# EAGLE design SparkFun Qwiic ToF Imager - VL53L5CX - Mini (EAGLE 9.6.2)
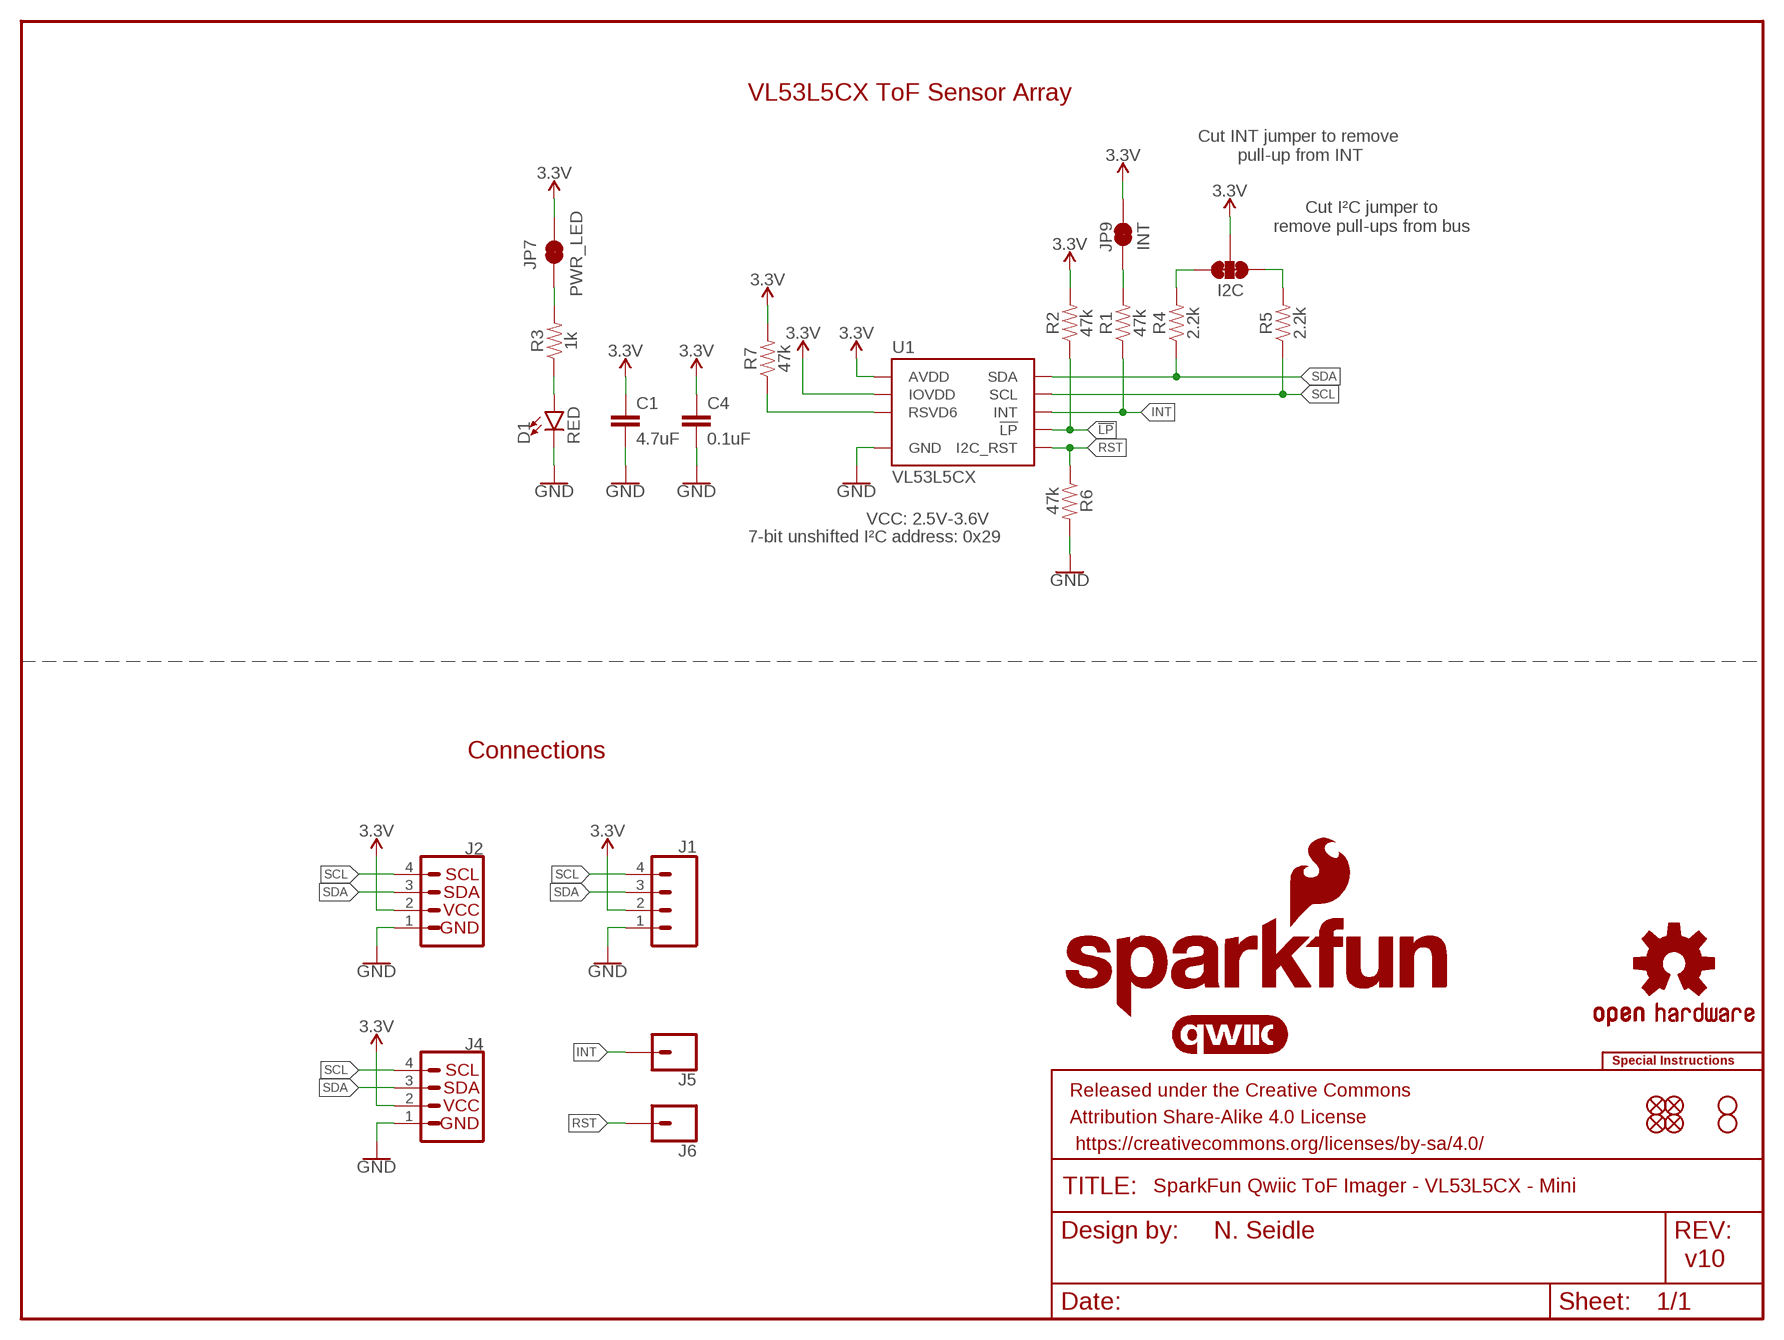
[diagram p0: schematic, sheet 1]

## Parts
C1  4.7uF  4.7UF-0402_TIGHT-6.3V-20%-X5R  [0402-TIGHT]
C4  0.1uF  0.1UF-0402T-6.3V-10%-X7R  [0402-TIGHT]
D1  RED  LED-RED0603  [LED-0603]
FRAME1  FRAME-LETTER  [CREATIVE_COMMONS]
I2C  JUMPER-SMT_3_2-NC_TRACE_SILK  [SMT-JUMPER_3_2-NC_TRACE_SILK]
J1  CONN_041X04_NO_SILK  [1X04_NO_SILK]
J2  Vertical Qwiic Connector  QWIIC_CONNECTOR  [JST04_1MM_VERT]
J4  Vertical Qwiic Connector  QWIIC_CONNECTOR  [JST04_1MM_VERT]
J5  CONN_01PTH_NO_SILK_YES_STOP  [1X01_NO_SILK]
J6  CONN_01PTH_NO_SILK_YES_STOP  [1X01_NO_SILK]
JP1  FIDUCIALUFIDUCIAL  [FIDUCIAL-MICRO]
JP2  FIDUCIALUFIDUCIAL  [FIDUCIAL-MICRO]
JP5  FIDUCIALUFIDUCIAL  [FIDUCIAL-MICRO]
JP6  FIDUCIALUFIDUCIAL  [FIDUCIAL-MICRO]
JP7  PWR_LED  JUMPER-SMT_2_NC_TRACE_SILK  [SMT-JUMPER_2_NC_TRACE_SILK]
JP9  INT  JUMPER-SMT_2_NC_TRACE_SILK  [SMT-JUMPER_2_NC_TRACE_SILK]
JP10  STAND-OFF  [STAND-OFF]
JP11  STAND-OFF  [STAND-OFF]
LOGO1  SFE_LOGO_NAME_FLAME8_MM  [SFE_LOGO_NAME_FLAME_8MM]
LOGO2  OSHW-LOGONO_SILK  [DUMMY]
LOGO3  QWIIC_LOGO_CONNECTOR  [QWIIC_5.5MM]
LOGO4  SFE_LOGO_NAME6_MM  [SFE_LOGO_NAME_6MM]
LOGO5  SPECIAL_INSTRUCTIONS-ORDERING  [ORDERING_INSTRUCTIONS]
R1  47k  47KOHM-0402-1/10W-1%  [0402-TIGHT]
R2  47k  47KOHM-0402-1/10W-1%  [0402-TIGHT]
R3  1k  1KOHM-0402T-1/16W-1%  [0402-TIGHT]
R4  2.2k  2.2KOHM-0402T-1/16W-1%  [0402-TIGHT]
R5  2.2k  2.2KOHM-0402T-1/16W-1%  [0402-TIGHT]
R6  47k  47KOHM-0402-1/10W-1%  [0402-TIGHT]
R7  47k  47KOHM-0402-1/10W-1%  [0402-TIGHT]
U1  VL53L5CX  [VL53L5CX]

## Nets
3.3V: C1.1 C4.1 I2C.2 J1.2 J2.2 J4.2 JP7.2 JP9.2 R2.2 R7.2 U1.A4(IOVDD) U1.B1(AVDD) U1.B7(AVDD)
!LP: R2.1 U1.A5(!LP)
GND: C1.2 C4.2 D1.C J1.1 J2.1 J4.1 R6.2 U1.A2(GND) U1.A6(GND) U1.A7(GND) U1.B4(GND) U1.C1(GND) U1.C6(GND) U1.C7(GND)
INT: J5.1 R1.1 U1.A3(INT)
N$1: I2C.1 R5.2
N$2: I2C.3 R4.2
N$3: D1.A R3.1
N$4: JP9.1 R1.2
N$5: JP7.1 R3.2
N$6: R7.1 U1.C2(RSVD6)
RST: J6.1 R6.1 U1.A1(I2C_RST)
SCL: J1.4 J2.4 J4.4 R5.1 U1.C4(SCL)
SDA: J1.3 J2.3 J4.3 R4.1 U1.C3(SDA)

## Notes on the sheet
- VL53L5CX ToF Sensor Array
- Cut INT jumper to remove 
  pull-up from INT
- Cut I²C jumper to
  remove pull-ups from bus
- VCC: 2.5V-3.6V
- 7-bit unshifted I²C address: 0x29
- Connections
- N. Seidle
- v10

## Library data of the parts
C1 = SparkFun-Capacitors:4.7UF: 4.7µF ceramic capacitors A capacitor is a passive two-terminal electrical component used to store electrical energy temporarily in an electric field.; PROD_ID: CAP-14240
C4 = SparkFun-Capacitors:0.1UF: 0.1µF ceramic capacitors A capacitor is a passive two-terminal electrical component used to store electrical energy temporarily in an electric field.; PROD_ID: CAP-14993
D1 = SparkFun-LED:LED-RED: Red SMD LED Used in manufacturing of most products at SparkFun Packages: 0603 - SMD 0603 package [Product Link] <http://docs.avagotech.com/docs/AV02-0551EN> 0603 SMART - SMD 0603 SMART package ( more efficient and expensive)[Product Link] <http://www.osram-os.com/Graphics/XPic2/00077099_0.pdf> 1206 - SMD1206 package [Product Link] <https://www.sparkfun.com/datasheets/DevTools/LilyPad/Q150OVS4.pdff> SparkFun Products: Pro Mini 328 -5V <https://www.sparkfun.com/products/821> RedBoard <https://www.sparkfun.com/products/12757> IOIO-OTG <https://www.sparkfun.com/products/13613>; PROD_ID: DIO-00819
FRAME1 = SparkFun-Aesthetics:FRAME-LETTER: Schematic Frame - Letter Standard 8.5x11 US Letter frame
I2C = SparkFun-Jumpers:JUMPER-SMT_3_2-NC_TRACE: Normally closed trace jumper (2 of 2 connections) This jumper has a trace between all three pads so they are normally closed (NC). Use a razor knife to open the connection(s). For best results follow the IPC guidelines for cutting traces: Cutout at least 0.063 mm (0.005 in). Remove all loose material to clean up the cut area. Seal the cut with an approved epoxy. Reapply solder to reclose the connection(s).
J1 = SparkFun-Connectors:CONN_04: Multi connection point. Often used as Generic Header-pin footprint for 0.1 inch spaced/style header connections On any of the 0.1 inch spaced packages, you can populate with these: Break Away Headers - Straight <https://www.sparkfun.com/products/116> (PRT-00116) Break Away Male Headers - Right Angle <https://www.sparkfun.com/products/553> (PRT-00553) Female Headers <https://www.sparkfun.com/products/115> (PRT-00115) Break Away Headers - Machine Pin <https://www.sparkfun.com/products/117> (PRT-00117) Break Away Female Headers - Swiss Machine Pin <https://www.sparkfun.com/products/743> (PRT-00743) For SCREWTERMINALS and SPRING TERMINALS visit here: Screw Terimnals on SparkFun.com <https://www.sparkfun.com/search/results?term=Screw+Terminals> (5mm/3.5mm/2.54mm spacing) This device is also useful as a general connection point to wire up your design to another part of your project. Our various solder wires solder well into these plated through hole pads. Hook-Up Wire - Assortment (Stranded, 22 AWG) <https://www.sparkfun.com/products/11375> (PRT-11375) Hook-Up Wire - Assortment (Solid Core, 22 AWG) <https://www.sparkfun.com/products/11367> (PRT-11367) View the entire wire category on our website here <https://www.sparkfun.com/categories/141> Special notes: Molex polarized connector foot print use with SKU : PRT-08231 with associated crimp pins and housings. 1MM SMD Version SKU: PRT-10208; PROD_ID: CONN-09696
J2 J4 = SparkFun-Connectors:QWIIC_CONNECTOR: SparkFun I2C Standard Qwiic Connector An SMD 1mm pitch JST connector makes it easy and quick (get it? Qwiic?) to connect I2C devices to each other. The Qwiic system <http://www.sparkfun.com/qwiic> enables fast and solderless connection between popular platforms and various sensors and actuators. We carry 200mm <https://www.sparkfun.com/products/14204>, 100mm <https://www.sparkfun.com/products/14205>, 50mm <https://www.sparkfun.com/products/14206>, and breadboard friendly <https://www.sparkfun.com/products/14207> Qwiic cables. We also offer 10 pcs strips <https://www.sparkfun.com/products/14323> the SMD connectors.; PROD_ID: CONN-14483
J5 J6 = SparkFun-Connectors:CONN_01: Single connection point. Often used as Generic Header-pin footprint for 0.1 inch spaced/style header connections On any of the 0.1 inch spaced packages, you can populate with these: Break Away Headers - Straight <https://www.sparkfun.com/products/116> (PRT-00116) Break Away Male Headers - Right Angle <https://www.sparkfun.com/products/553> (PRT-00553) Female Headers <https://www.sparkfun.com/products/115> (PRT-00115) Break Away Headers - Machine Pin <https://www.sparkfun.com/products/117> (PRT-00117) Break Away Female Headers - Swiss Machine Pin <https://www.sparkfun.com/products/743> (PRT-00743) This device is also useful as a general connection point to wire up your design to another part of your project. Our various solder wires solder well into these plated through hole pads. Hook-Up Wire - Assortment (Stranded, 22 AWG) <https://www.sparkfun.com/products/11375> (PRT-11375) Hook-Up Wire - Assortment (Solid Core, 22 AWG) <https://www.sparkfun.com/products/11367> (PRT-11367) View the entire wire category on our website here <https://www.sparkfun.com/categories/141> Special notes: SMTSO-256-ET is a "flush mount" nut for a 4-40 screw. We mostly use this on specialty testbeds; it is a nice way to connect hardware to your PCB at an adjustable hieght. Also note, the SNAP packages are for using a snappable style connector. We sell a baggie of snaps and they are also used on two LilyPad designs: Snap Assortment - 30 pack (male and female) <https://www.sparkfun.com/products/11347> (DEV-11347) LilyPad Arduino SimpleSnap <https://www.sparkfun.com/products/10941> (DEV-10941) LilyPad SimpleSnap Protoboard <https://www.sparkfun.com/products/10940> (DEV-10940)
JP1 JP2 JP5 JP6 = SparkFun-Aesthetics:FIDUCIAL: Fiducial Alignment Points Point-of-reference for pick-and-place machines and other optical instruments.
JP7 JP9 = SparkFun-Jumpers:JUMPER-SMT_2_NC_TRACE: Normally closed trace jumper This jumper has a trace between two pads so it's normally closed (NC). Use a razor knife to open the connection. For best results follow the IPC guidelines for cutting traces: Cutout at least 0.063 mm (0.005 in). Remove all loose material to clean up the cut area. Seal the cut with an approved epoxy. Reapply solder to reclose the connection.
JP10 JP11 = SparkFun-Hardware:STAND-OFF: Stand Off Drill holes for mechanically mounting via screws, standoffs, etc. Note: Use the keepout ring to avoid running the screw head into surrounding components. Variant Overviews STAND-OFF - Mechanical footprint for a #4 phillips button head screw. STAND-OFF-TIGHT - Mechanical footprint for a #4 phillips button head screw, Example SparkFun Products Screw - Phillips Head (1/4", 4-40, 10 pack) <https://www.sparkfun.com/products/10453> (PRT-10453) Screw - Phillips Head (1/2", 4-40, 10 pack) <https://www.sparkfun.com/products/10452> (PRT-10452) Screw - Phillips Head (3/4", 4-40, 10 pack) <https://www.sparkfun.com/products/10451> (PRT-10451) Screw - Phillips Head (1", 4-40, 10 pack) <https://www.sparkfun.com/products/10450> (PRT-10450)
LOGO1 = SparkFun-Aesthetics:SFE_LOGO_NAME_FLAME: SparkFun Font Logo w/ Flame This is the SparkFun full logo. The logo on the schematic will always be the same size; the package variant is the height of the flame part of the logo. Default layer for the logo on the board is tSilk.
LOGO2 = SparkFun-Aesthetics:OSHW-LOGO: Open-Source Hardware (OSHW) Logo This logo indicates the piece of hardware it is found on incorporates a OSHW license and/or adheres to the definition of open source hardware found here: http://freedomdefined.org/OSHW
LOGO3 = SparkFun-Aesthetics:QWIIC_LOGO: Qwiic Logos for placement on schematic and PCB. The 5.5mm silk logo is best for placing next to Qwiic connector.
LOGO4 = SparkFun-Aesthetics:SFE_LOGO_NAME: SparkFun Font Logo This is the SparkFun name logo. The logo on the schematic will always be the same size; the package variant is the height of the flame part of the logo (or the height the flame would be, if it were drawn). Default layer for the logo on the board is tSilk.
LOGO5 = SparkFun-Aesthetics:SPECIAL_INSTRUCTIONS: Special Ordering/Production Instructions Alert Symbol for special PCB ordering instructions or unique production process warnings. Ordering Instructions Production Instructions Types of information that should be added to box: Copper weight Soldermask color Silk color PCB thickness Number of layers PCB Standard: 1.6mm FR4 1 oz copper immersion silver plating red soldermask white silkscreen Types of information that should be added to box: Special wash requirements Depaneling instructions Humidification Glue curing Default text settings: 0.07 inch 9% ratio 50% line distance
R1 R2 R6 R7 = SparkFun-Resistors:47KOHM: 47kΩ resistor A resistor is a passive two-terminal electrical component that implements electrical resistance as a circuit element. Resistors act to reduce current flow, and, at the same time, act to lower voltage levels within circuits. - Wikipedia; PROD_ID: RES-15011
R3 = SparkFun-Resistors:1KOHM: 1kΩ resistor A resistor is a passive two-terminal electrical component that implements electrical resistance as a circuit element. Resistors act to reduce current flow, and, at the same time, act to lower voltage levels within circuits. - Wikipedia; PROD_ID: RES-14342
R4 R5 = SparkFun-Resistors:2.2KOHM: 2.2kΩ resistor A resistor is a passive two-terminal electrical component that implements electrical resistance as a circuit element. Resistors act to reduce current flow, and, at the same time, act to lower voltage levels within circuits. - Wikipedia; PROD_ID: RES-14341
U1 = SparkFun-Sensors:VL53L5CX; PROD_ID: IC-16254

## Net classes
1 power: width 0.203 mm

## Board
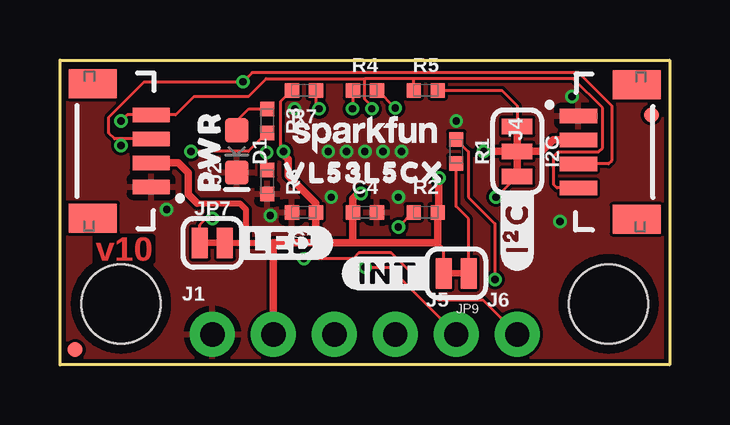
[diagram p1: board, top side]
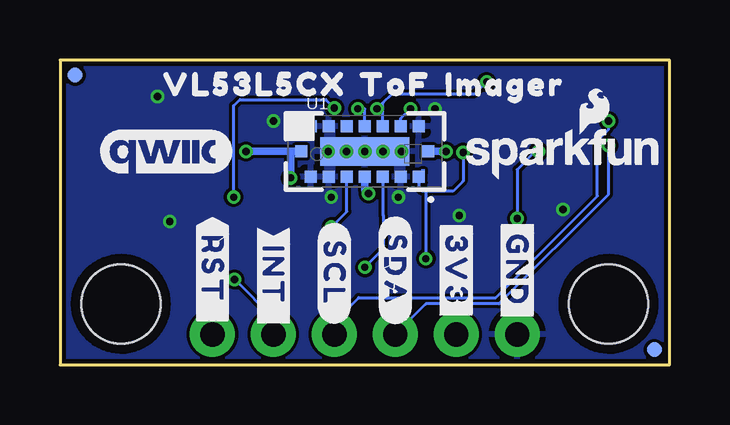
[diagram p2: board, bottom side, seen from below]

Size 25.4 x 12.7 mm. Coordinates in mm from the lower left corner, seen from the top.
Outline: 0,0 0,12.7 25.4,12.7 25.4,0 0,0
Copper layers (1*16): Top/Vert 0.035mm / dielectric 1.5mm / Bottom/Horz 0.035mm
Design rules "SparkFun-2-Layer-Minimum-JLCPCB": minimum track width 5mil, minimum drill 0.3mm, track to track 5mil, track to pad 5mil, pad to pad 5mil, via to via 5mil, smd to smd 5mil, copper to edge 7mil, drill to drill 7mil, minimum pad ring 5mil, minimum via ring 5mil, stop-mask expansion 2.5mil, vias tented up to drill 25mil, thermal gap 10mil

### Footprints (pad centres in the part's own frame; a part is rotated, then mirrored left to right if it is on the bottom)
0402-TIGHT = smd 0.6 x 0.6: 1 -0.5,0; 2 0.5,0
LED-0603 = smd 1 x 1: A -0.877,0; C 0.877,0
SMT-JUMPER_3_2-NC_TRACE_SILK = smd 0.66 x 1.27: 1 -1.041,0; 2 0,0; 3 1.041,0
1X04_NO_SILK = drill 1.016 pad 1.88: 1 0,0; 2 2.54,0; 3 5.08,0; 4 7.62,0
JST04_1MM_VERT = smd 0.6 x 1.55: 1 -1.478,0.775; 2 -0.478,0.775; 3 0.522,0.775; 4 1.522,0.775 | smd 1.2 x 2: NC1 -2.778,3.2; NC2 2.822,3.2
1X01_NO_SILK = drill 1.016 pad 1.88: 1 0,0
FIDUCIAL-MICRO = smd 0.635 x 0.635: 1 0,0
SMT-JUMPER_2_NC_TRACE_SILK = smd 0.66 x 1.27: 1 -0.521,0; 2 0.521,0
STAND-OFF = hole 3.302: 0,0
VL53L5CX = smd 0.5 x 0.5: A1 2.25,-1.05; A2 1.5,-1.05; A3 0.75,-1.05; A4 0,-1.05; A5 -0.75,-1.05; A6 -1.5,-1.05; A7 -2.25,-1.05; B1 2.65,0; B7 -2.65,0; C1 2.25,1.05; C2 1.5,1.05; C3 0.75,1.05; C4 0,1.05; C5 -0.75,1.05; C6 -1.5,1.05; C7 -2.25,1.05 | smd 3.7 x 1.2: B4 0,0

### Placement (x,y rotation side)
C1  10.16,6.35 180 top
C4  12.7,6.35 0 top
D1  7.37,8.89 270 top
FRAME1  -14.63,-15.24 0 top  (outside the outline)
I2C  19.05,8.89 270 top
J1  6.35,1.27 0 top
J2  4.57,8.89 90 top
J4  20.83,8.89 270 top
J5  16.51,1.27 0 top
J6  19.05,1.27 0 top
JP1  0.64,0.64 0 bottom
JP2  24.64,10.41 0 top
JP5  24.77,12.06 0 bottom
JP6  0.64,0.64 0 top
JP7  6.35,5.08 0 top
JP9  16.51,3.81 180 top
JP10  2.54,2.54 0 top
JP11  22.86,2.54 0 top
LOGO1  4.47,8.89 0 bottom
LOGO2  -13.97,-15.24 0 top  (outside the outline)
LOGO3  20.98,8.89 0 bottom
LOGO4  12.7,9.65 0 top
LOGO5  30.48,50.8 0 top  (outside the outline)
R1  16.51,8.89 270 top
R2  15.24,6.35 0 top
R3  8.64,10.16 270 top
R4  12.7,11.43 0 top
R5  15.24,11.43 0 top
R6  8.64,7.62 270 top
R7  10.16,11.43 180 top
U1  12.7,8.89 0 bottom
U$1  [VL53L5CX_0]  12.83,8 0 top
U$2  [#LED#0]  9.27,5.08 0 top
U$3  [#3V3#13]  8.89,3.94 270 bottom
U$4  [PWR12]  6.22,8.89 90 top
U$5  [#INT#0]  13.72,3.81 0 top
U$8  [#INT_#0]  16.51,3.56 270 bottom
U$9  [#RST_#1]  19.05,3.81 270 bottom
U$16  [#I�C#0]  19.05,5.71 90 top
U$19  [VL53L5CX0]  17.27,11.68 0 bottom
U$20  [TOF1]  11.43,11.68 0 bottom
U$22  [IMAGER2]  6.86,11.68 0 bottom
U$24  [#SCL#1]  13.97,3.81 270 bottom
U$25  [#SDA#0]  11.43,3.94 270 bottom
U$30  [#GND#62130]  6.35,3.94 270 bottom

### Tracks (layer width: path | path; a pad name or v marks a point on that pad's centre or on a via)
3.3V  (via drill 0.3)
  Top/Vert 0.127: 12.2,5.09 12.19,5.08 | 10.66,5.09 10.67,5.08 | 9.31,8.77 v9.31,8.89 9.18,9.02 9.18,10.96 R7.2 | 15.79,6.4 R2.2 | JP9.2 15.99,4.84 15.75,5.08
  Top/Vert 0.254: JP7.2 7.75,5.08 | 7.75,5.08 8.89,5.08 | 7.75,5.08 7.75,6.48 7.49,6.73 5.71,6.73
  Top/Vert 0.305: J4.2 20.54,9.37 20.07,8.89 I2C.2 v17.65,8.89 | 5.71,6.73 5.33,7.11 5.33,8 4.92,8.41 J2.2 | 12.2,5.09 C4.1 12.2,6.92 12.42,7.14 v12.54,7.14 | 10.66,5.09 C1.1 10.66,6.74 9.52,7.88 9.52,8.56 9.31,8.77 | v15.79,7.79 15.79,6.4 | R2.2 15.75,5.08 12.19,5.08 10.67,5.08 8.89,5.08 J1.2
  Bottom/Horz 0.127: 15.79,8.85 15.75,8.89
  Bottom/Horz 0.305: v12.54,7.14 12.7,7.29 U1.A4 | U1.B1 v9.31,8.89 | v17.65,8.89 15.75,8.89 U1.B7 | v15.79,7.79 15.79,8.85
!LP  (via drill 0.3)
  Top/Vert 0.127: R2.1 14.71,6.35 v14.1,5.74
  Bottom/Horz 0.127: v14.1,5.74 13.45,6.39 U1.A5
GND  (via drill 0.3)
  other vias: 4.45,6.48 12.7,8.89 11.94,8.89 11.18,8.89 13.46,8.89 14.22,8.89 21.34,11.18 16.51,10.16 14.1,6.99 8.76,6.22 11.3,6.99 20.83,5.97 9.78,10.67
  pour Bottom/Horz (isolate 0.127): 0,0 0,12.7 25.4,12.7 25.4,0
  pour Top/Vert (isolate 0.127): 0,0 0,12.7 25.4,12.7 25.4,0
  pour Bottom/Horz (isolate 0.178, no thermals): 14.35,10.03 14.35,7.62 13.97,7.62 13.97,10.03
  pour Bottom/Horz (isolate 0.178, no thermals): 11.43,9.02 11.43,7.75 11.05,7.75 11.05,9.02
INT  (via drill 0.3)
  Top/Vert 0.127: v12.7,4.06 13.72,4.06 J5.1 | R1.1 17.02,8.88 17.02,6.99 18.12,5.88 v18.12,3.56
  Bottom/Horz 0.127: U1.A3 11.95,6.24 11.94,6.22 11.94,4.83 v12.7,4.06 | v18.12,3.56 16.51,1.94 J5.1
N$1
  Top/Vert 0.127: R5.2 18.41,11.43 19.05,10.79 I2C.1
N$2  (via drill 0.3)
  Top/Vert 0.127: I2C.3 18.19,6.99 v18.16,6.99 | v13.97,10.7 13.24,11.43 R4.2
  Bottom/Horz 0.127: v18.16,6.99 18.16,10.79 17.91,11.05 14.32,11.05 v13.97,10.7
N$3
  Top/Vert 0.127: D1.A 7.37,10.16 7.87,10.67 8.63,10.67 R3.1
N$4
  Top/Vert 0.127: R1.2 16.51,6.6 17.03,6.08 JP9.1
N$5  (via drill 0.3)
  Top/Vert 0.127: R3.2 8.62,9.66 7.85,8.89 v5.46,8.89 | JP7.1 5.83,5.83 6.1,6.1 v6.35,6.1
  Bottom/Horz 0.127: v6.35,6.1 6.35,8.13 5.59,8.89 v5.46,8.89
N$6  (via drill 0.3)
  Top/Vert 0.127: v10.79,10.67 10.66,10.8 R7.1
  Bottom/Horz 0.127: U1.C2 11.2,10.26 v10.79,10.67
RST  (via drill 0.3)
  Top/Vert 0.127: v10.16,4.42 12.21,4.42 12.45,4.66 13.8,4.66 15.77,2.69 17.63,2.69 J6.1 | R6.1 8.6,8.16 v8.6,8.85
  Bottom/Horz 0.127: U1.A1 10.45,7.37 10.32,7.24 10.16,7.24 | 10.16,7.24 v10.16,4.42 | v8.6,8.85 8.6,7.66 9.02,7.24 10.16,7.24
SCL  (via drill 0.3)
  Top/Vert 0.127: v12.99,10.67 12.99,10.77 12.7,11.06 12.7,11.92 | 12.7,11.92 8.59,11.92 7.84,11.17 5.58,11.17 4.81,10.41 J2.4 2.79,10.41 v2.54,10.16 | J4.4 20.7,7.37 20.57,7.49 20.57,8.68 20.77,8.88 22.46,8.88 22.61,9.03 22.61,10.71 21.39,11.92 14.73,11.92 | 14.73,11.92 12.7,11.92 | R5.1 14.73,11.92
  Bottom/Horz 0.127: U1.C4 12.7,10.67 v12.99,10.67 | v2.54,10.16 2.54,9.81 3.01,9.34 3.01,7.02 7.24,2.79 12.95,2.79 13.97,1.78 J1.4
SDA  (via drill 0.3)
  Top/Vert 0.127: R4.1 v12.2,10.68 v12.19,10.67 | J4.3 22.85,8.37 22.99,8.51 22.99,10.79 21.61,12.18 8,12.18 v7.62,11.79 3.51,11.79 2.03,10.32 2.03,9.65 2.27,9.41 2.54,9.41 | J2.3 2.54,9.41 | v2.54,9.14 2.54,9.41
  Bottom/Horz 0.127: U1.C3 11.95,10.67 | v2.54,9.14 2.54,7.11 7.11,2.54 10.16,2.54 J1.3 | 11.95,10.67 11.95,10.91 11.56,11.3 8.11,11.3 v7.62,11.79 | v12.19,10.67 11.95,10.67

### Text on the board
Top/Vert: v10
tDocu: 2-Layer Board / 0.8mm Thickness / 1oz Copper | N. Seidle